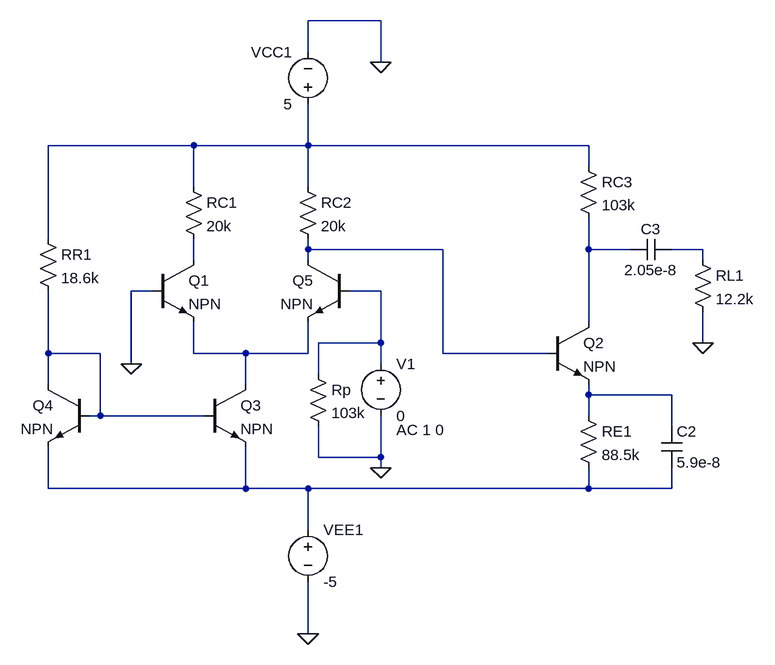
[diagram p0: schematic FCircuit.asc]
FCircuit.asc, the LTspice schematic file:
Version 4
SHEET 1 1556 1072
WIRE 688 112 576 112
WIRE 576 160 576 112
WIRE 688 176 688 112
WIRE 400 304 176 304
WIRE 576 304 576 240
WIRE 576 304 400 304
WIRE 1008 304 576 304
WIRE 1008 336 1008 304
WIRE 400 368 400 304
WIRE 576 368 576 304
WIRE 176 448 176 304
WIRE 576 464 576 448
WIRE 784 464 576 464
WIRE 1008 464 1008 416
WIRE 1072 464 1008 464
WIRE 1184 464 1136 464
WIRE 400 480 400 448
WIRE 576 480 576 464
WIRE 1184 480 1184 464
WIRE 336 528 304 528
WIRE 688 528 640 528
WIRE 1008 576 1008 464
WIRE 688 608 688 528
WIRE 688 608 592 608
WIRE 1184 608 1184 560
WIRE 176 624 176 528
WIRE 256 624 176 624
WIRE 400 624 400 576
WIRE 480 624 400 624
WIRE 576 624 576 576
WIRE 576 624 480 624
WIRE 784 624 784 464
WIRE 944 624 784 624
WIRE 304 640 304 528
WIRE 688 640 688 608
WIRE 592 656 592 608
WIRE 176 672 176 624
WIRE 480 672 480 624
WIRE 1008 688 1008 672
WIRE 1136 688 1008 688
WIRE 256 720 256 624
WIRE 256 720 240 720
WIRE 416 720 256 720
WIRE 1008 720 1008 688
WIRE 1136 736 1136 688
WIRE 592 784 592 736
WIRE 688 784 688 720
WIRE 688 784 592 784
WIRE 688 800 688 784
WIRE 176 832 176 768
WIRE 480 832 480 768
WIRE 480 832 176 832
WIRE 576 832 480 832
WIRE 1008 832 1008 800
WIRE 1008 832 576 832
WIRE 1136 832 1136 800
WIRE 1136 832 1008 832
WIRE 576 896 576 832
WIRE 576 1056 576 976
FLAG 1184 608 0
FLAG 576 1056 0
FLAG 688 176 0
FLAG 304 640 0
FLAG 688 800 0
SYMBOL res 384 352 R0
SYMATTR InstName RC1
SYMATTR Value 20k
SYMBOL res 560 352 R0
SYMATTR InstName RC2
SYMATTR Value 20k
SYMBOL Res 992 704 R0
SYMATTR InstName RE1
SYMATTR Value 88.5k
SYMBOL Res 160 432 R0
SYMATTR InstName RR1
SYMATTR Value 18.6k
SYMBOL Res 992 320 R0
SYMATTR InstName RC3
SYMATTR Value 103k
SYMBOL npn 336 480 R0
SYMATTR InstName Q1
SYMBOL npn 944 576 R0
SYMATTR InstName Q2
SYMBOL npn 416 672 R0
SYMATTR InstName Q3
SYMBOL npn 240 672 M0
SYMATTR InstName Q4
SYMBOL npn 640 480 M0
SYMATTR InstName Q5
SYMBOL voltage 576 880 R0
SYMATTR InstName VEE1
SYMATTR Value -5
SYMBOL voltage 576 256 R180
WINDOW 0 24 96 Left 2
WINDOW 3 24 16 Left 2
SYMATTR InstName VCC1
SYMATTR Value 5
SYMBOL Res 1168 464 R0
SYMATTR InstName RL1
SYMATTR Value 12.2k
SYMBOL Voltage 688 624 R0
WINDOW 123 24 118 Left 2
SYMATTR Value2 AC 1 0
SYMATTR InstName V1
SYMATTR Value 0
SYMBOL cap 1136 448 R90
WINDOW 0 0 32 VBottom 2
WINDOW 3 32 32 VTop 2
SYMATTR InstName C3
SYMATTR Value 2.05e-8
SYMBOL cap 1120 736 R0
SYMATTR InstName C2
SYMATTR Value 5.9e-8
SYMBOL Res 576 640 R0
SYMATTR InstName Rp
SYMATTR Value 103k

The netlist it stands for:
* FCircuit.asc
RC1 N001 N005 20k
RC2 N001 N002 20k
RE1 N009 N010 88.5k
RR1 N001 N007 18.6k
RC3 N001 N003 103k
Q1 N005 0 N008 0 NPN
Q2 N003 N002 N009 0 NPN
Q3 N008 N007 N010 0 NPN
Q4 N007 N007 N010 0 NPN
Q5 N002 N006 N008 0 NPN
VEE1 N010 0 -5
VCC1 N001 0 5
RL1 N004 0 12.2k
V1 N006 0 0 AC 1 0
C3 N004 N003 2.05e-8
C2 N009 N010 5.9e-8
Rp N006 0 103k
.model NPN NPN
.model PNP PNP
.lib standard.bjt
.backanno
.end